# Altium schematic sheet Sch_Sh1.SchDoc
size A
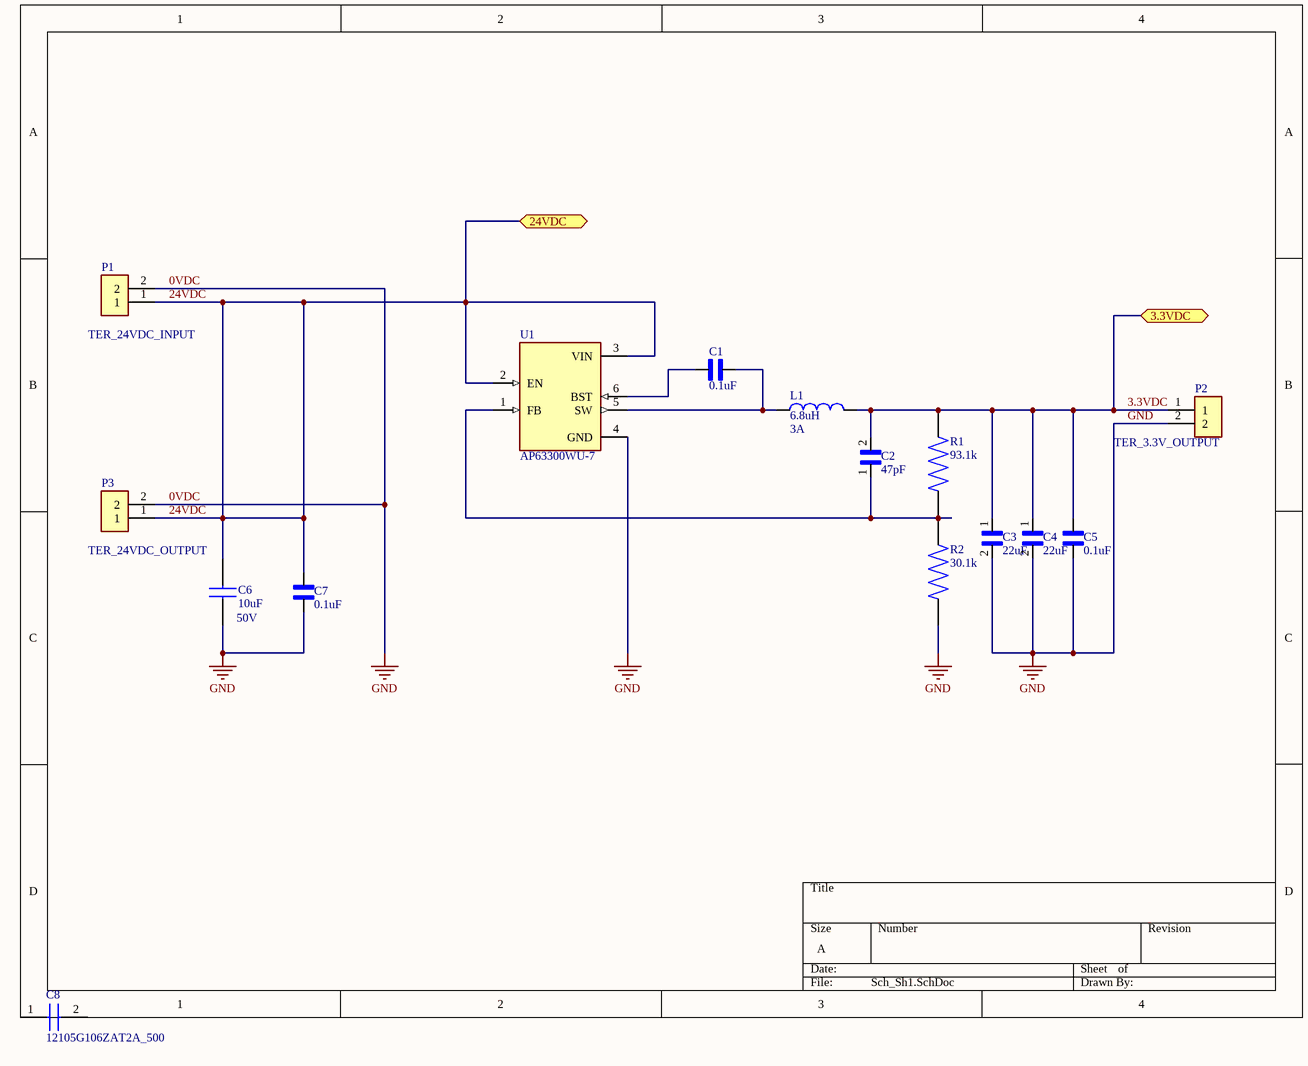
[diagram p0: Sch_Sh1.SchDoc]

## Parts
C1  0.1uF  [WCAP-CSGP_885012205086]
C2  47pF  [CAPC2012X145N]
C3  22uF  [CAPC2012X140N]
C4  22uF  [CAPC2012X140N]
C5  0.1uF  [WCAP-CSGP_885012205086]
C6  10uF  [CAPC3225X290N]
C7  0.1uF  [WCAP-CSGP_885012205086]
C8  12105G106ZAT2A_500  [CAPC3225X290N]
L1  6.8uH  [INDC3225X170N]
P1  Comment_1: TER_24VDC_INPUT  [TE_282837-2]  (hidden comment: 282837-2)
P2  Comment_1: TER_3.3V_OUTPUT  [TE_282837-2]  (hidden comment: 282837-2)
P3  Comment_1: TER_24VDC_OUTPUT  [TE_282837-2]  (hidden comment: 282837-2)
R1  93.1k  [RESC1005X40N]
R2  30.1k  [RES_ERJ2RKF3012X]
U1  AP63300WU-7  [SOT95P280X100-6N]

## Ports
3.3VDC, 24VDC

## Nets
0VDC: C3.2 C4.2 C5.1 C6.1 C7.1 P1.2 P2.2 P3.2 R2.1 U1.4(GND)  [also labelled GND]
3.3VDC: C2.2 C3.1 C4.1 C5.2 L1.2 P2.1 R1.2 ; port 3.3VDC
24VDC: C6.2 C7.2 P1.1 P3.1 U1.2(EN) U1.3(VIN) ; port 24VDC
NetC1_1: C1.1 L1.1 U1.5(SW)
NetC1_2: C1.2 U1.6(BST)
NetC2_1: C2.1 R1.1 R2.2 U1.1(FB)

Not connected (* = marked no-connect by the designer): C8 1 2

## Notes on the sheet
- (in symbol 12105G106ZAT2A_500) 50V
- (in symbol BRL3225T6R8M) 3A

## Library data of the parts
C1 C5 C7 = 885012205086: <b> WCAP-CSGP Ceramic Capacitors <br> <br> <br><b>Characteristics </b><br> </b><br>Multilayer Ceramic Chip Capacitor <br>Recommended soldering:Reflow, for 0603 and 0805 wave soldering is also allowed <br>Operating temperature:-55 Â°C to +125 Â°C; <br>Ceramic characteristics: Class I - NPO ; Class II -X7R, X5R <br>High performance ceramic <br>High capacitance stability <br>Minimal aging  <br>Termination:Cu/Ni/Sn <br>   <br><a href="http://katalog.we-online.de/media/images/eisos/WCAP-CSGP_pf2.jpg" title="Enlarge picture"> <img src="http://katalog.we-online.de/media/thumbs2/eisos/thb_WCAP-CSGP_pf2.jpg" width="320"></a><p> Details see: <a href="http://katalog.we-online.de/en/pbs/WCAP-CSGP-0402?">http://katalog.we-online.de/en/pbs/WCAP-CSGP-0402? </a><p>Created:  2015-01-28 <br>2015 (C) Wurth Elektronik; Package: None; Price: None; Value: *; MP: 885012205086; Availability: Unavailable
C2 = GRM21BC8YA106KE11L: SMD Capacitor X6S_EIA_ with Capacitance: 10uF Tol. 10%. Rated Voltage: 35Vdc; MF: Murata; MP: GRM21BC8YA106KE11L; Digi-Key_Purchase_URL: https://www.digikey.com/product-detail/en/murata-electronics/GRM21BC8YA106KE11L/490-10504-1-ND/5026432?utm_source=snapeda&utm_medium=aggregator&utm_campaign=symbol; SnapEDA_Link: https://www.snapeda.com/parts/GRM21BC8YA106KE11L/Murata/view-part/4383596/?ref=snap; Package: 2012 Murata; Value: *; Digi-Key_Part_Number: 490-10504-1-ND
C3 C4 = CL21A226MAQNNNE: 22ÂµF Â±20% 25V Ceramic Capacitor X5R 0805 (2012 Metric); MF: Samsung; SnapEDA_Link: https://www.snapeda.com/parts/CL21A226MAQNNNE/Samsung%20Electro-Mechanics/view-part/620487/?ref=snap; Check_prices: https://www.snapeda.com/parts/CL21A226MAQNNNE/Samsung%20Electro-Mechanics/view-part/620487/?ref=eda; Digi-Key_Part_Number: 1276-2908-1-ND; MP: CL21A226MAQNNNE; Value: *; Package: 0805 Samsung; Purchase-URL: https://pricing.snapeda.com/search/part/CL21A226MAQNNNE/?ref=eda
C6 = 12105G106ZAT2A_500: CAP CER 10UF 50V Y5V 1210; Manufacturer_Name: AVX; Manufacturer_Part_Number: 12105G106ZAT2A/500; Geometry.Height: 2.9mm; Mouser Part Number: *; Mouser Price/Stock: *; Arrow Part Number: *; Arrow Price/Stock: *; Datasheet Link: http://datasheets.avx.com/Y5V.pdf
C8 = 12105G106ZAT2A_500: Capacitor; Manufacturer_Name: AVX; Manufacturer_Part_Number: 12105G106ZAT2A/500; Datasheet Link: http://datasheets.avx.com/Y5V.pdf; Height: 2.9mm
L1 = BRL3225T6R8M: INDUCTOR, 6.8UH, 1.05A, +20%; Package: None; Price: None; Value: *; MP: BRL3225T6R8M; Availability: Unavailable
P1-P3 = 282837-2: Connector Terminal Blocks Receptacle 2 Position 5.08mm Solder Straight Thru-Hole 13.5A/Contact; MF: TE Connectivity; Check_prices: https://www.snapeda.com/parts/282837-2/TE+Connectivity+AMP+Connectors/view-part/?ref=eda; Value: *; Availability: In Stock; MP: 282837-2; Price: None; Package: None; SnapEDA_Link: https://www.snapeda.com/parts/282837-2/TE+Connectivity+AMP+Connectors/view-part/?ref=snap; Purchase-URL: https://pricing.snapeda.com/search/part/282837-2/?ref=eda
R1 = RC0402FR-0793K1L: Res Thick Film 0402 93.1K Ohm 1% 1/16W Â±100ppm/Â°C Molded SMD Paper T/R; Package: None; Price: None; Value: *; MP: RC0402FR-0793K1L; Availability: Unavailable
R2 = ERJ2RKF3012X: Price: None; MP: ERJ2RKF3012X; Package: None; Value: *; Availability: Unavailable
U1 = AP63300WU-7: Buck Switching Regulator IC Positive Adjustable 0.8V 1 Output 3A SOT-23-6 Thin, TSOT-23-6; MF: Diodes Incorporated; SnapEDA_Link: https://www.snapeda.com/parts/AP63300WU-7/Diodes%20Inc./view-part/4221814/?ref=snap; Availability: Unavailable; MP: AP63300WU-7; DigiKey-Purchase-URL: https://snapeda.com/shop?store=DigiKey&id=4221814; Price: None; Value: *; Package: SOT-23-6 Diodes Incorporated